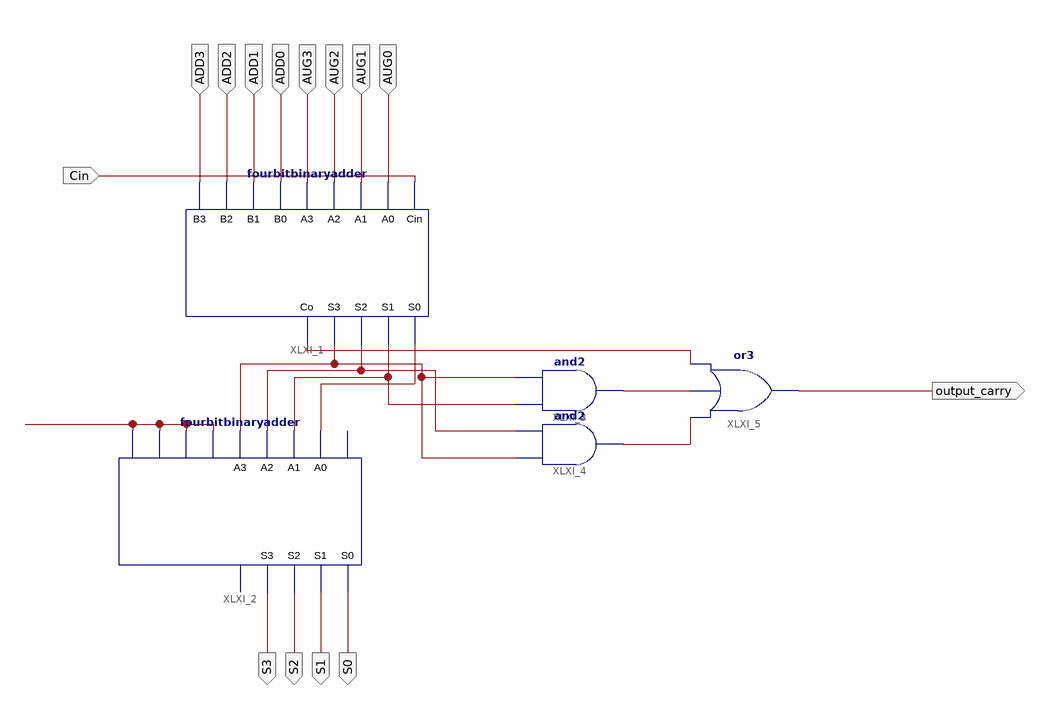
[diagram p0: schematic sheet 1]
// Xilinx ISE schematic BCDadderblock.sch (artix7) as structural Verilog: 5 symbols, 14 ports
module BCDadderblock (
  input  Cin,
  input  AUG0,
  input  AUG1,
  input  AUG2,
  input  AUG3,
  input  ADD0,
  input  ADD1,
  input  ADD2,
  input  ADD3,
  output S0,
  output S1,
  output S2,
  output S3,
  output output_carry
);

  wire XLXN_7, XLXN_8, XLXN_9, XLXN_10, XLXN_11, XLXN_12, XLXN_14, XLXN_15;

  fourbitbinaryadder XLXI_1 (
    .A0(AUG0), .B0(ADD0), .A1(AUG1), .B1(ADD1), .B2(ADD2), .A2(AUG2), .A3(AUG3), .B3(ADD3), .Cin(Cin),
    .Co(XLXN_11), .S2(XLXN_9), .S1(XLXN_8), .S3(XLXN_10), .S0(XLXN_7));
  fourbitbinaryadder XLXI_2 (
    .A0(XLXN_7), .B0(XLXN_12), .A1(XLXN_8), .B1(XLXN_12), .B2(XLXN_12), .A2(XLXN_9), .A3(XLXN_10),
    .B3(XLXN_12), .S2(S2), .S1(S1), .S3(S3), .S0(S0));  // open: Cin, Co
  and XLXI_3 (XLXN_14, XLXN_8, XLXN_10);
  and XLXI_4 (XLXN_15, XLXN_10, XLXN_9);
  or XLXI_5 (output_carry, XLXN_15, XLXN_14, XLXN_11);
endmodule
